# EAGLE design h-bridge_0.8 (EAGLE 8.0.0)

## Sheet 1 of 2
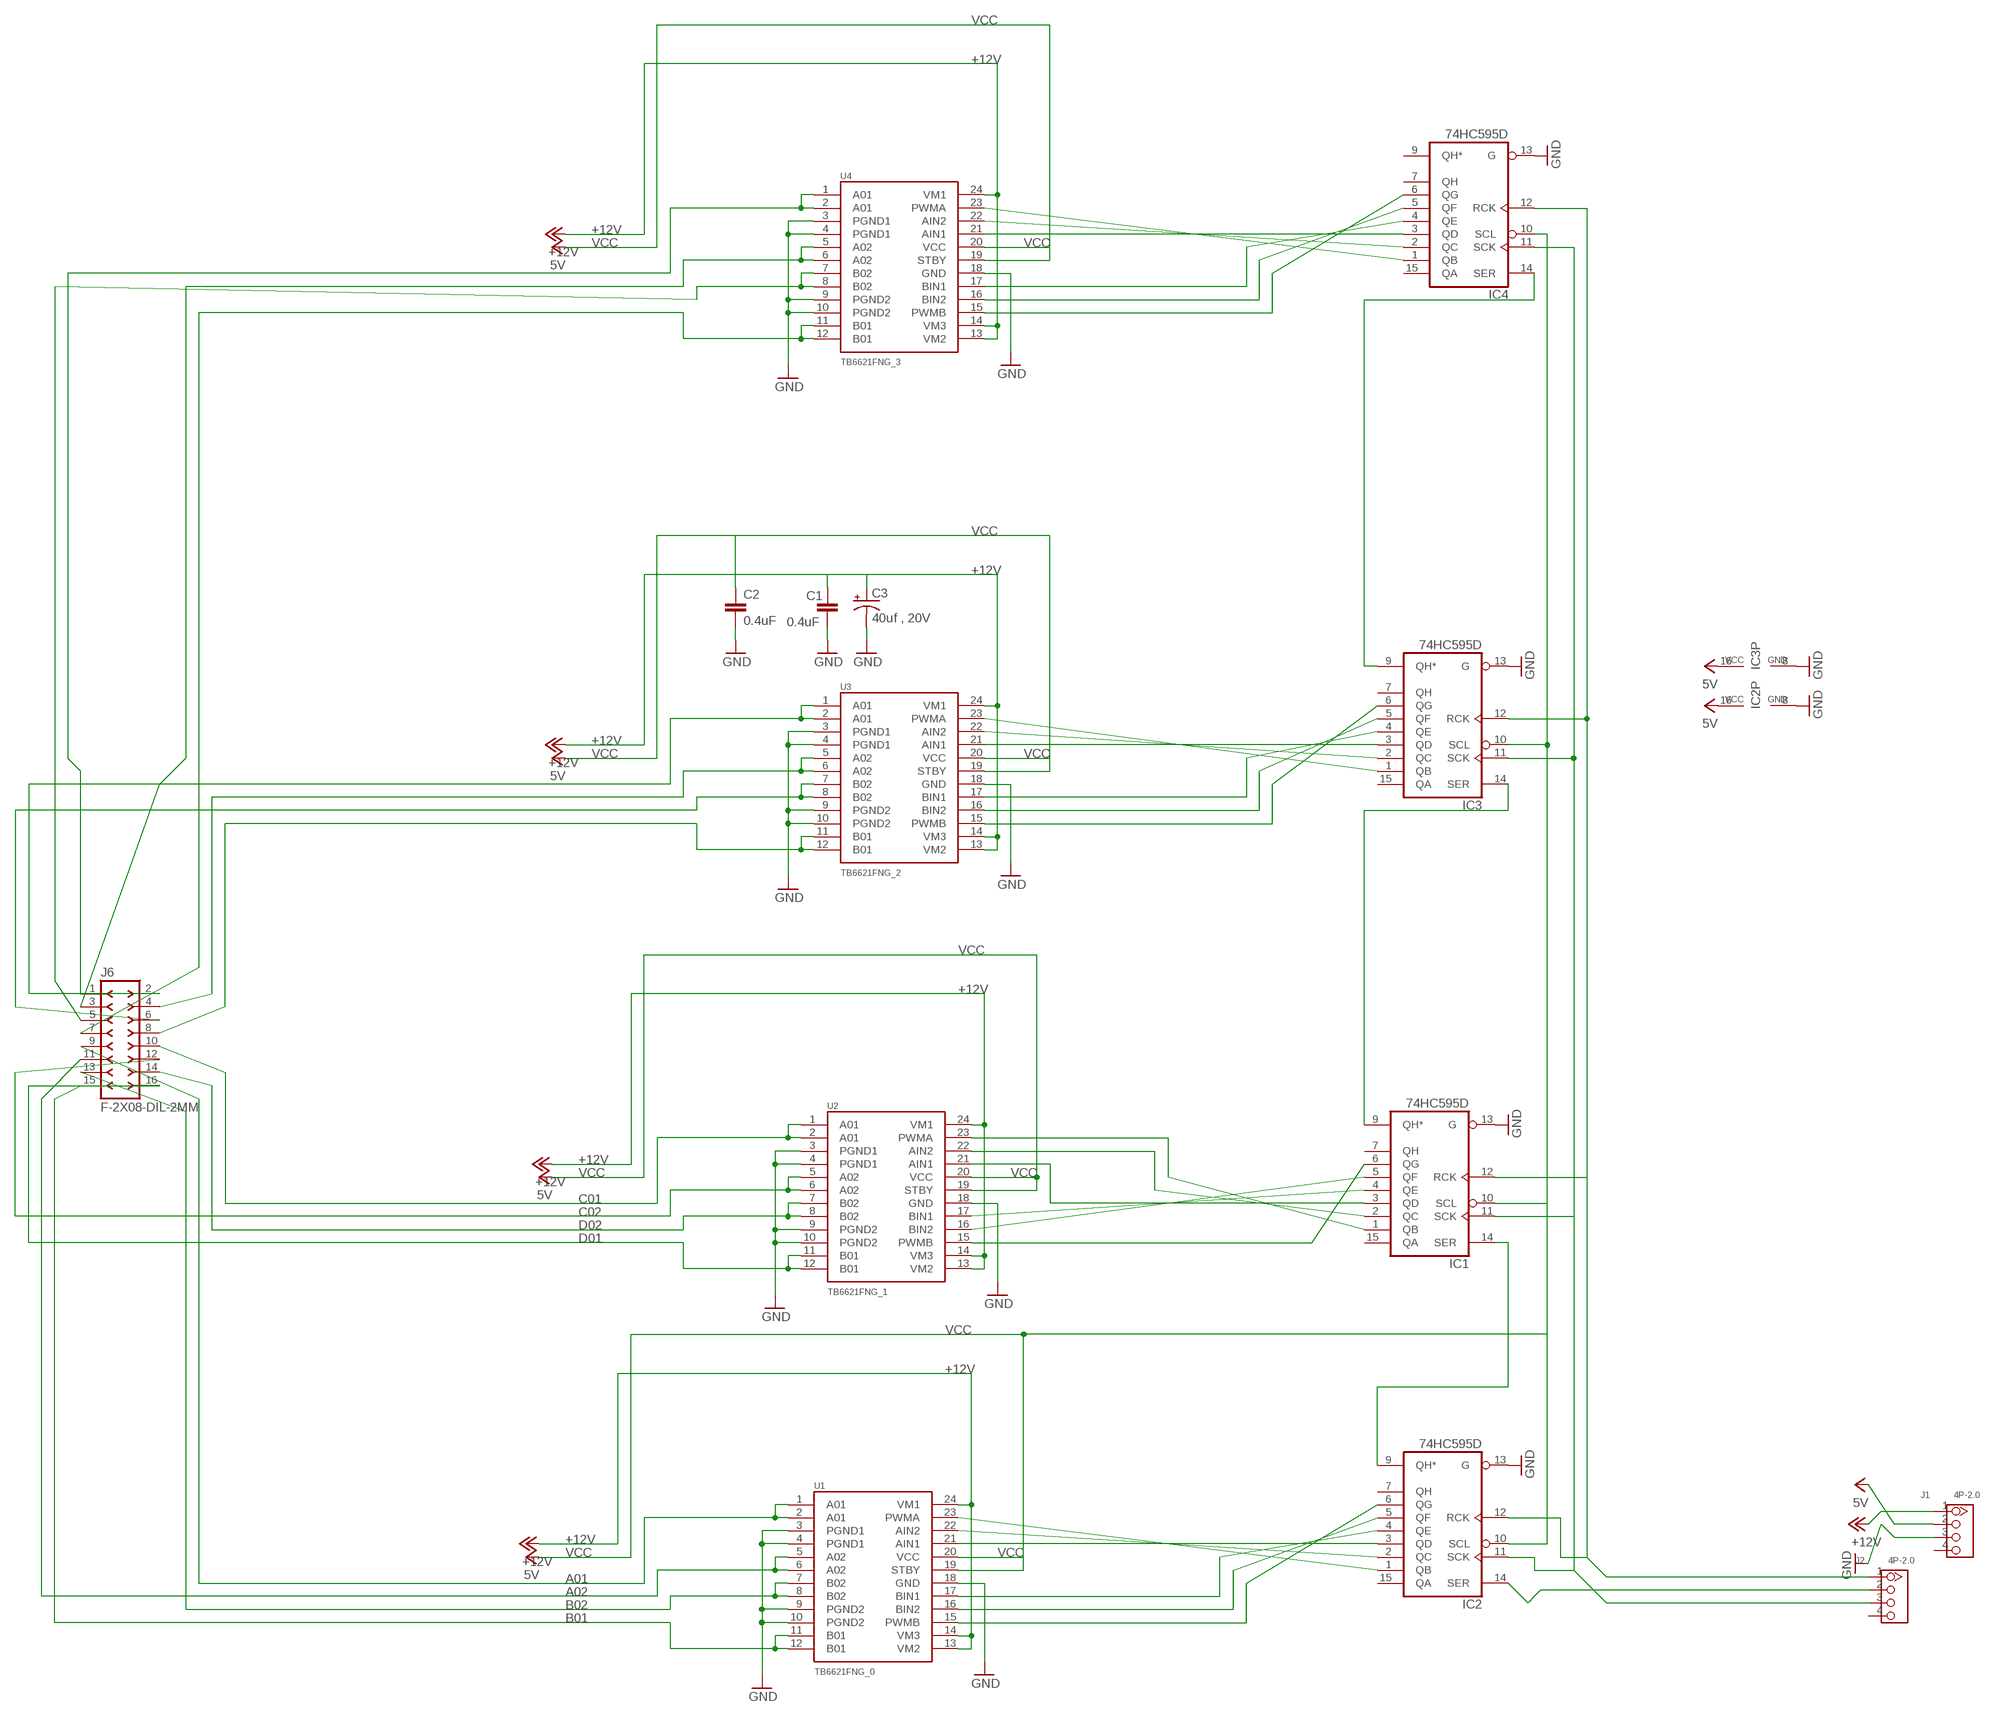
[diagram p0: schematic, sheet 1]

### Parts
C1  0.4uF  CAP0402-CAP  [0402-CAP]
C2  0.4uF  CAP0402-CAP  [0402-CAP]
C3  40uf , 20V  CAP_POL3528  [EIA3528]
IC1  74HC595D  [SO16]
IC2  74HC595D  [SO16]
IC3  74HC595D  [SO16]
IC4  74HC595D  [SO16]
J1  4P-2.0  GROVE-CONNECTOR-DIP(4P-2.0)  [HW4-2.0]
J2  4P-2.0  GROVE-CONNECTOR-DIP(4P-2.0)  [HW4-2.0]
J6  F-2X08-DIL-2MM  [DIL-2MM-2X08]
U1  TB6621FNG_0  TB6621FNG  [SSOP24]
U2  TB6621FNG_1  TB6621FNG  [SSOP24]
U3  TB6621FNG_2  TB6621FNG  [SSOP24]
U4  TB6621FNG_3  TB6621FNG  [SSOP24]

### Nets
+12V: C1.1 C3.A(+) J1.1 U1.13(VM2) U1.14(VM3) U1.24(VM1) U2.13(VM2) U2.14(VM3) U2.24(VM1) U3.13(VM2) U3.14(VM3) U3.24(VM1) U4.13(VM2) U4.14(VM3) U4.24(VM1)
A01: J6.9 U1.1(A01) U1.2(A01)
A02: J6.11 U1.5(A02) U1.6(A02)
B01: J6.15 U1.11(B01) U1.12(B01)
B02: J6.13 U1.7(B02) U1.8(B02)
C01: J6.10 U2.1(A01) U2.2(A01)
C02: J6.12 U2.5(A02) U2.6(A02)
D01: J6.16 U2.11(B01) U2.12(B01)
D02: J6.14 U2.7(B02) U2.8(B02)
E01: J6.2 U3.1(A01) U3.2(A01)
E01A: J6.1 U4.1(A01) U4.2(A01)
E02: J6.4 U3.5(A02) U3.6(A02)
E02A: J6.5 U4.7(B02) U4.8(B02)
F01: J6.8 U3.11(B01) U3.12(B01)
F01A: J6.7 U4.11(B01) U4.12(B01)
F02: J6.6 U3.7(B02) U3.8(B02)
F02A: J6.3 U4.5(A02) U4.6(A02)
GND: C1.2 C2.2 C3.C(-) IC1.13(G) IC2.8(GND) IC2.13(G) IC3.8(GND) IC3.13(G) IC4.13(G) J1.3 U1.3(PGND1) U1.4(PGND1) U1.9(PGND2) U1.10(PGND2) U1.18(GND) U2.3(PGND1) U2.4(PGND1) U2.9(PGND2) U2.10(PGND2) U2.18(GND) U3.3(PGND1) U3.4(PGND1) U3.9(PGND2) U3.10(PGND2) U3.18(GND) U4.3(PGND1) U4.4(PGND1) U4.9(PGND2) U4.10(PGND2) U4.18(GND)
N$1: IC2.5(QF) U1.16(BIN2)
N$2: IC3.5(QF) U3.16(BIN2)
N$3: IC2.2(QC) U1.22(AIN2)
N$4: IC3.4(QE) U3.17(BIN1)
N$5: IC2.6(QG) U1.15(PWMB)
N$6: IC2.1(QB) U1.23(PWMA)
N$8: IC2.14(SER) J2.2
N$10: IC1.14(SER) IC2.9(QH*)
N$11: IC2.4(QE) U1.17(BIN1)
N$12: IC1.6(QG) U2.15(PWMB)
N$13: IC2.3(QD) U1.21(AIN1)
N$14: IC1.5(QF) U2.16(BIN2)
N$15: IC1.4(QE) U2.17(BIN1)
N$16: IC1.3(QD) U2.21(AIN1)
N$17: IC1.2(QC) U2.22(AIN2)
N$18: IC1.9(QH*) IC3.14(SER)
N$19: IC1.1(QB) U2.23(PWMA)
N$20: IC3.3(QD) U3.21(AIN1)
N$21: IC3.6(QG) U3.15(PWMB)
N$22: IC3.2(QC) U3.22(AIN2)
N$24: IC3.1(QB) U3.23(PWMA)
N$25: IC1.11(SCK) IC2.11(SCK) IC3.11(SCK) IC4.11(SCK)
N$26: IC1.12(RCK) IC2.12(RCK) IC3.12(RCK) IC4.12(RCK) J2.1
N$27: IC4.6(QG) U4.15(PWMB)
N$28: IC3.9(QH*) IC4.14(SER)
N$29: IC4.5(QF) U4.16(BIN2)
N$30: IC4.4(QE) U4.17(BIN1)
N$31: IC4.3(QD) U4.21(AIN1)
N$33: IC4.2(QC) U4.22(AIN2)
N$34: IC4.1(QB) U4.23(PWMA)
VCC: C2.1 IC1.10(SCL) IC2.10(SCL) IC2.16(VCC) IC3.10(SCL) IC3.16(VCC) IC4.10(SCL) J1.2 U1.19(STBY) U1.20(VCC) U2.19(STBY) U2.20(VCC) U3.19(STBY) U3.20(VCC) U4.19(STBY) U4.20(VCC) ; supply symbol labelled 5V
Unconnected: IC1.7(QH) IC1.15(QA) IC2.7(QH) IC2.15(QA) IC3.7(QH) IC3.15(QA) IC4.7(QH) IC4.9(QH*) IC4.15(QA) J1.4 J2.3 J2.4

## Sheet 2 of 2

## Power pins joined to a net without a drawn wire
GND: IC1.8(GND) IC4.8(GND)
VCC: IC1.16(VCC) IC4.16(VCC)

## Library data of the parts
C1 C2 = SparkFun:CAP: Capacitor Standard 0603 ceramic capacitor, and 0.1" leaded capacitor.
C3 = SparkFun:CAP_POL: Capacitor Polarized These are standard SMD and PTH capacitors. Normally 10uF, 47uF, and 100uF in electrolytic and tantalum varieties. Always verify the external diameter of the through hole cap, it varies with capacity, voltage, and manufacturer. The EIA devices should be standard.
IC1-IC4 = 74xx-eu:74*595: 8-bit SHIFT REGISTER, output latch
J1 J2 = Seeed-OPL-Connector:GROVE-CONNECTOR-DIP(4P-2.0): 320110033
J6 = con-headers-jp:F-2X08-: FEMALE HEADER
U1-U4 = SparkFun:TB6621FNG: Toshiba 1A motor driver

## Board
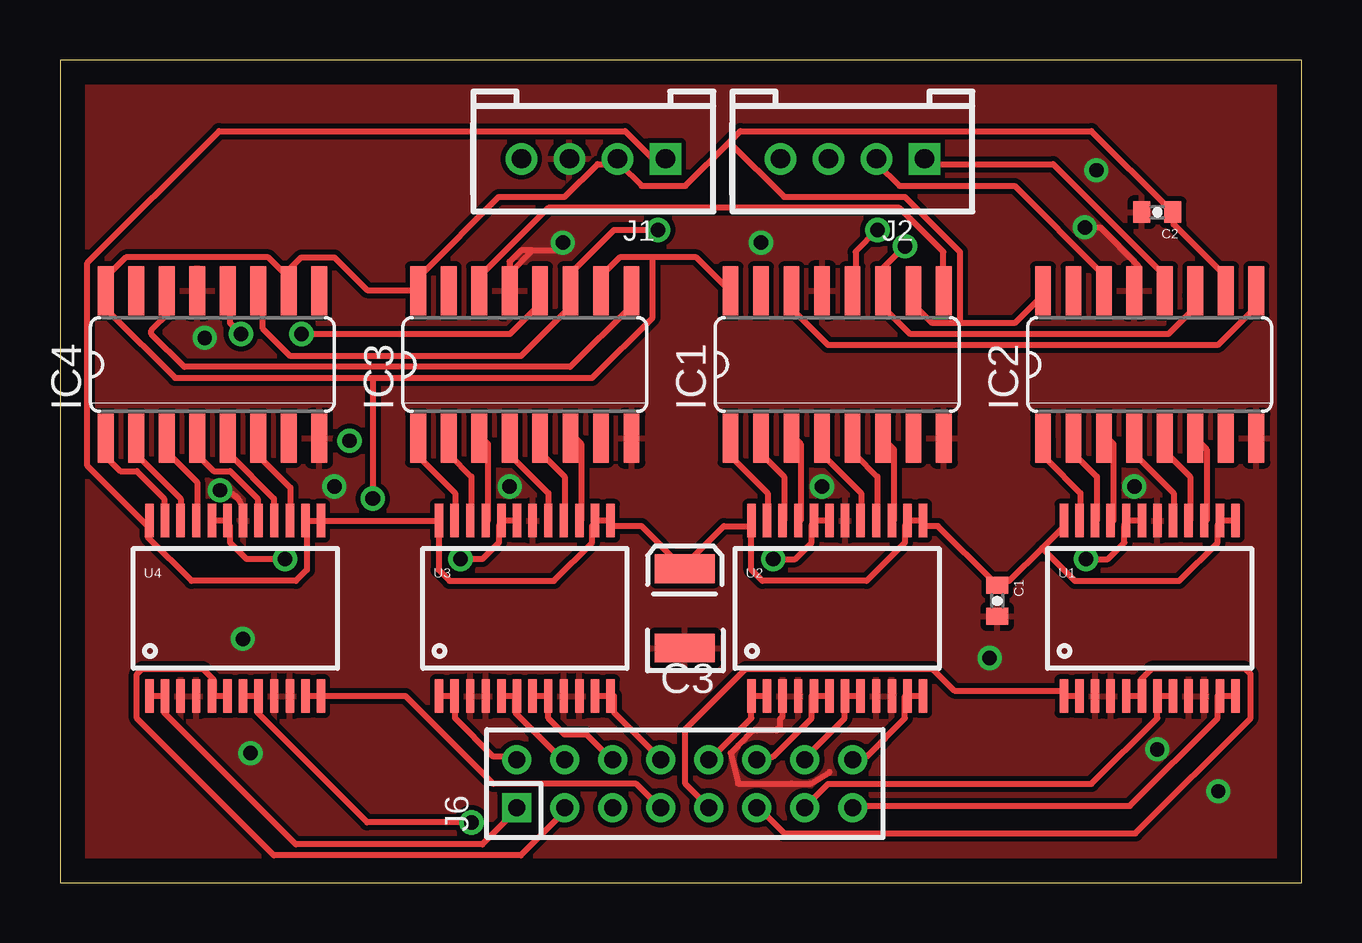
[diagram p1: board, top side]
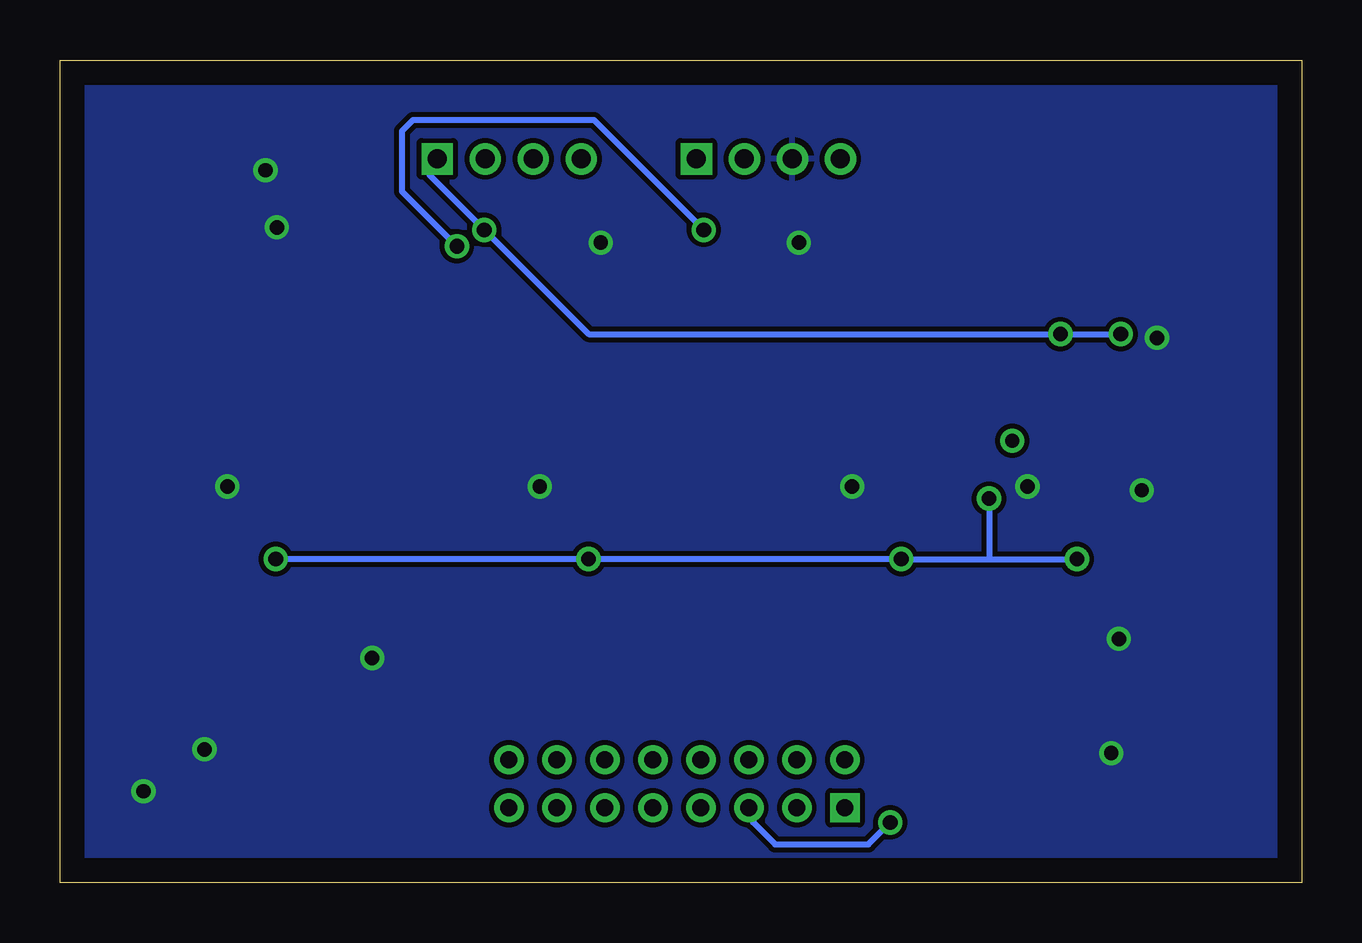
[diagram p2: board, bottom side, seen from below]

Size 51.74 x 34.28 mm. Coordinates in mm from the lower left corner, seen from the top.
Outline: 0,0 51.74,0 51.74,34.28 0,34.28 0,0
Copper layers (1*16): Top 0.035mm / dielectric 1.5mm / Bottom 0.035mm
Design rules "default": minimum track width 10mil, minimum drill 24mil, track to track 8mil, track to pad 8mil, pad to pad 8mil, via to via 8mil, smd to smd 8mil, copper to edge 40mil, drill to drill 8mil, minimum pad ring 10mil, minimum via ring 8mil, stop-mask expansion 4mil, vias tented up to drill 0mil, thermal gap 10mil

### Footprints (pad centres in the part's own frame; a part is rotated, then mirrored left to right if it is on the bottom)
0402-CAP = smd 0.7 x 0.9: 1 -0.65,0; 2 0.65,0
EIA3528 = smd 1.2 x 2.5: A 1.65,0; C -1.65,0
SO16 = smd 0.66 x 2.032: 1 -4.445,-3.073; 2 -3.175,-3.073; 3 -1.905,-3.073; 4 -0.635,-3.073; 5 0.635,-3.073; 6 1.905,-3.073; 7 3.175,-3.073; 8 4.445,-3.073; 9 4.445,3.073; 10 3.175,3.073; 11 1.905,3.073; 12 0.635,3.073; 13 -0.635,3.073; 14 -1.905,3.073; 15 -3.175,3.073; 16 -4.445,3.073
HW4-2.0 = drill 0.8 pad 1.27 square: 1 -3,0 | drill 0.8 pad 1.27: 2 -1,0; 3 1,0; 4 3,0
DIL-2MM-2X08 = drill 0.711 square: 1 -7,-1 | drill 0.711: 2 -7,1; 3 -5,-1; 4 -5,1; 5 -3,-1; 6 -3,1; 7 -1,-1; 8 -1,1; 9 1,-1; 10 1,1; 11 3,-1; 12 3,1; 13 5,-1; 14 5,1; 15 7,-1; 16 7,1
SSOP24 = smd 0.348 x 1.397: 1 -3.575,-3.656; 2 -2.925,-3.656; 3 -2.275,-3.656; 4 -1.625,-3.656; 5 -0.975,-3.656; 6 -0.325,-3.656; 7 0.325,-3.656; 8 0.975,-3.656; 9 1.625,-3.656; 10 2.275,-3.656; 11 2.925,-3.656; 12 3.575,-3.656; 13 3.575,3.656; 14 2.925,3.656; 15 2.275,3.656; 16 1.625,3.656; 17 0.975,3.656; 18 0.325,3.656; 19 -0.325,3.656; 20 -0.975,3.656; 21 -1.625,3.656; 22 -2.275,3.656; 23 -2.925,3.656; 24 -3.575,3.656

### Placement (x,y rotation side)
C1  39.05,11.75 270 top
C2  45.72,27.94 180 top
C3  26.04,11.43 90 top
IC1  32.38,21.59 0 top
IC2  45.4,21.59 0 top
IC3  19.37,21.59 0 top
IC4  6.35,21.59 0 top
J1  22.23,30.16 180 top
J2  33.02,30.16 180 top
J6  26.04,4.13 0 top
U1  45.4,11.43 0 top
U2  32.38,11.43 0 top
U3  19.37,11.43 0 top
U4  7.3,11.43 0 top

### Tracks (layer width: path | path; a pad name or v marks a point on that pad's centre or on a via)
+12V
  Top 0.254: 28.8,14.86 27.66,14.86 26.06,13.26 C3.A 25.83,13.26 24.23,14.86 23.09,14.86 U3.13 22.86,15.09 22.4,15.09 U3.14 22.17,14.86 22.17,14.17 20.57,12.57 16.23,12.57 15.77,13.03 15.77,14.86 U3.24 15.77,15.09 10.97,15.09 U4.13 10.74,15.09 10.29,15.09 U4.14 10.29,14.86 10.29,13.03 9.83,12.57 5.49,12.57 3.66,14.4 3.66,14.86 | U1.13 48.92,15.09 48.46,15.09 U1.14 48.23,14.86 48.23,14.17 46.63,12.57 42.29,12.57 40.92,13.95 | 40.92,13.95 41.83,14.86 U1.24 | 40.92,13.95 39.55,12.57 39.09,12.57 C1.1 38.86,12.57 36.58,14.86 36.12,14.86 U2.13 35.89,15.09 35.43,15.09 U2.14 35.2,14.86 35.2,14.17 33.6,12.57 29.26,12.57 28.8,13.03 28.8,14.86 | 28.8,14.86 U2.24 | 3.66,14.86 1.14,17.37 1.14,25.83 6.63,31.32 23.55,31.32 24.69,30.18 25.15,30.18 J1.1 | 3.66,14.86 U4.24
A01
  Top 0.254: U1.2 42.52,7.77 U1.1 41.83,8 37.26,8 36.35,8.91 28.57,8.91 26.06,6.4 26.06,4.12 26.98,3.2 J6.9
A02
  Top 0.254: U1.5 44.58,7.77 45.03,7.77 U1.6 45.03,8 45.03,8.46 45.49,8.91 49.38,8.91 49.61,8.69 49.61,6.86 44.81,2.06 30.18,2.06 29.26,2.97 J6.11
B01
  Top 0.254: U1.12 48.92,7.77 48.46,7.77 U1.11 48.23,7.77 48.23,6.86 44.58,3.2 33.15,3.2 J6.15
B02
  Top 0.254: U1.7 46.41,7.77 U1.8 | U1.7 45.72,6.86 42.98,4.12 32,4.12 31.09,3.2 J6.13 | U1.7
C01
  Top 0.254: U2.1 29.49,7.77 U2.2 | U2.1 28.8,6.86 27.2,5.26 J6.10 | U2.1
C02
  Top 0.254: U2.6 32,7.77 31.55,7.77 U2.5 31.32,7.77 31.32,6.86 29.72,5.26 29.26,5.26 J6.12
D01
  Top 0.254: U2.12 35.89,7.77 35.43,7.77 U2.11 35.2,7.77 35.2,6.86 33.6,5.26 33.15,5.26 J6.16
D02
  Top 0.254: 32.69,7.77 33.38,7.77 U2.8 | 32.69,7.77 32.69,6.86 31.09,5.26 J6.14 | 32.69,7.77 U2.7
E01
  Top 0.254: 16.46,7.77 15.77,7.77 U3.1 | 16.46,7.77 16.46,6.86 18.06,5.26 18.97,5.26 J6.2 | 16.46,7.77 U3.2
E01A
  Top 0.254: 4.34,7.77 3.89,7.77 U4.1 | 4.34,7.77 4.34,7.09 9.83,1.6 17.6,1.6 18.97,2.97 J6.1 | 4.34,7.77 U4.2
E02
  Top 0.254: 18.97,7.77 18.52,7.77 U3.5 | 18.97,7.77 18.97,7.09 21.03,5.03 J6.4 | 18.97,7.77 U3.6
E02A  (via drill 0.61)
  Top 0.254: 8.23,7.77 7.77,7.77 U4.7 | 8.23,7.77 8.23,7.09 12.8,2.52 v17.14,2.52 | 8.23,7.77 U4.8
  Bottom 0.254: v17.14,2.52 18.06,1.6 21.95,1.6 22.86,2.52 22.86,2.97 J6.5
F01
  Top 0.254: U3.11 22.4,7.77 22.86,7.77 U3.12 23.09,7.77 23.09,7.09 24.92,5.26 J6.8
F01A
  Top 0.254: U4.11 10.29,7.77 10.74,7.77 U4.12 10.97,7.77 14.4,7.77 18.06,4.12 24,4.12 24.92,3.2 J6.7
F02
  Top 0.254: U3.8 19.66,7.77 U3.7 | U3.8 20.34,6.86 21.03,6.17 21.95,6.17 22.86,5.26 J6.6 | U3.8
F02A
  Top 0.254: U4.6 6.86,7.77 6.4,7.77 U4.5 6.4,8 6.4,8.46 5.94,8.91 3.43,8.91 3.2,8.69 3.2,6.86 8.91,1.14 19.2,1.14 21.03,2.97 J6.3
GND  (via drill 0.6)
  Top 0.254: v6.67,16.35 arc-90 7.63,15.39 U4.18 | 19.68,26.35 19.21,26.35 18.73,25.88 IC3.13 18.73,25.4 19.68,26.35 | 19.68,26.35 20.64,26.35 v20.95,26.67 | v42.7,27.3 43.34,27.3 44.93,25.72 44.93,24.82 IC2.13 | U2.3 30.11,6.93 30,6.83 30,6.51 29.84,6.35 29.05,6.35 28.89,6.35 28.26,5.71 27.94,5.4 28.26,4.13 30.48,4.13 31.27,4.13 32.07,4.6
  other vias: 7.62,10.16 7.94,5.4 11.43,16.51 6.03,22.7 18.73,16.51 29.21,26.67 31.75,16.51 44.77,16.51 38.73,9.37 43.18,29.69 45.72,5.56 48.26,3.81
  pour Top: -1.27,35.56 53.34,35.56 53.34,-1.27 -1.27,-1.27
  pour Bottom: 0,34.29 52.07,34.29 52.07,0 0,0
  pour Top: 7.62,15.88 7.62,15.56 7.3,15.88 6.03,15.88 6.03,16.83 6.99,16.83 6.99,16.51
  pour Top: 6.35,22.86 6.03,23.18 4.6,23.18 4.45,23.02 4.45,22.86 5.4,21.91 6.99,21.91 6.35,22.54
  pour Top: 19.05,25.4 19.53,25.88 21.27,25.88 23.02,27.62 20.48,27.62 18.26,25.4
  pour Top: 44.45,25.4 44.13,25.88 43.5,25.88 40.16,29.21 40.16,29.53 41.12,29.53 45.09,25.56 45.09,25.4
N$1
  Top 0.254: U1.16 47.09,15.09 47.09,16.92 46.18,17.83 46.18,18.52 IC2.5
N$2
  Top 0.254: U3.16 21.03,15.09 21.03,16.92 20.12,17.83 20.12,18.52 IC3.5
N$3
  Top 0.254: U1.22 43.2,15.09 43.2,16.92 42.29,17.83 42.29,18.52 IC2.2
N$4
  Top 0.254: U3.17 20.34,16.23 18.75,17.83 18.75,18.52 IC3.4
N$5
  Top 0.254: U1.15 47.78,15.09 47.78,18.06 IC2.6
N$6
  Top 0.254: U1.23 42.52,15.09 42.52,16.23 41.15,17.6 41.15,18.52 IC2.1
N$7  (via drill 0.6)
  other vias: 12.06,18.41
N$8
  Top 0.254: IC2.14 43.43,24.69 43.43,25.38 39.78,29.03 34.98,29.03 34.06,29.95 J2.2
N$9
  pour Bottom: 7.62,15.24 7.3,15.88 6.03,15.88 6.03,16.19 6.03,16.83 6.99,16.83 7.94,15.88 7.94,15.24
N$10
  Top 0.254: IC1.14 30.63,24.46 30.63,23.77 32,22.4 48.23,22.4 49.84,24 49.84,24.46 IC2.9
N$11
  Top 0.254: U1.17 46.41,15.09 46.41,16.23 44.81,17.83 44.81,18.52 IC2.4
N$12
  Top 0.254: IC1.6 34.75,18.06 34.75,15.09 U2.15
N$13
  Top 0.254: U1.21 43.89,15.09 43.89,18.29 43.66,18.52 IC2.3
N$14
  Top 0.254: U2.16 34.06,15.09 34.06,16.92 33.15,17.83 33.15,18.52 IC1.5
N$15
  Top 0.254: U2.17 33.38,15.09 33.38,16.23 31.77,17.83 31.77,18.52 IC1.4
N$16
  Top 0.254: U2.21 30.86,15.09 30.86,18.29 30.63,18.52 IC1.3
N$17
  Top 0.254: U2.22 30.18,15.09 30.18,16.92 29.26,17.83 29.26,18.52 IC1.2
N$18
  Top 0.254: IC3.14 17.6,24.69 17.6,25.38 20.34,28.12 34.98,28.12 36.8,26.29 36.8,24.69 IC1.9
N$19
  Top 0.254: U2.23 29.49,15.09 29.49,16.23 28.12,17.6 28.12,18.52 IC1.1
N$20
  Top 0.254: U3.21 17.83,15.09 17.83,18.29 17.6,18.52 IC3.3
N$21
  Top 0.254: U3.15 21.72,15.09 21.72,18.29 21.49,18.52 IC3.6
N$22
  Top 0.254: U3.22 17.14,15.09 17.14,16.92 16.23,17.83 16.23,18.52 IC3.2
N$24
  Top 0.254: U3.23 16.46,15.09 16.46,16.23 15.09,17.6 15.09,18.52 IC3.1
N$25  (via drill 0.61)
  Top 0.254: IC2.11 47.09,24.46 47.09,23.77 46.18,22.86 35.43,22.86 34.29,24 IC1.11 34.29,25.6 v35.2,26.52 | IC4.11 8.46,24.46 8.46,23.09 9.6,21.95 19.2,21.95 21.26,24 21.26,24.46 IC3.11 21.49,24.69 21.49,25.6 23.09,27.2 v24.92,27.2
  Bottom 0.254: v35.2,26.52 37.49,28.8 37.49,31.32 37.03,31.77 29.49,31.77 v24.92,27.2
N$26  (via drill 0.61)
  Top 0.254: v7.54,22.86 7.09,23.32 7.09,24.46 IC4.12 | v10.06,22.86 18.75,22.86 19.89,24 19.89,24.46 IC3.12 | v34.06,27.2 33.15,26.29 33.15,24.69 IC1.12 | IC2.12 45.95,24.69 45.95,25.38 41.38,29.95 36.12,29.95 J2.1
  Bottom 0.254: v7.54,22.86 v10.06,22.86 29.72,22.86 v34.06,27.2 36.35,29.49 36.35,29.72 36.12,29.95 J2.1
N$27
  Top 0.254: U4.15 9.6,15.09 9.6,16.46 8.46,17.6 8.46,18.52 IC4.6
N$28
  Top 0.254: IC4.14 4.57,24.46 4.57,23.77 3.81,23.01 3.81,22.86 5.18,21.49 21.26,21.49 23.77,24 23.77,24.46 IC3.9
N$29
  Top 0.254: U4.16 8.91,15.09 8.91,16 7.09,17.83 7.09,18.52 IC4.5
N$30
  Top 0.254: IC4.4 5.71,17.83 6.4,17.14 7.09,17.14 8.23,16 8.23,15.09 U4.17
N$31
  Top 0.254: U4.21 5.71,15.09 5.71,16.69 4.57,17.83 4.57,18.52 IC4.3
N$33
  Top 0.254: U4.22 5.03,16 3.2,17.83 3.2,18.52 IC4.2
N$34
  Top 0.254: U4.23 4.34,15.09 4.34,16 3.2,17.14 2.52,17.14 2.06,17.6 2.06,18.52 IC4.1
VCC  (via drill 0.61)
  Top 0.254: U1.19 45.03,15.09 44.58,15.09 U1.20 44.35,14.86 44.35,14.17 43.66,13.49 v42.75,13.49 | U2.19 32,15.09 31.55,15.09 U2.20 31.32,14.86 31.32,14.17 30.63,13.49 v29.72,13.49 | U4.20 6.4,15.09 6.86,15.09 U4.19 7.09,14.86 7.09,14.17 7.77,13.49 v9.37,13.49 | U3.19 18.97,15.09 18.52,15.09 U3.20 18.29,14.86 18.29,14.17 17.6,13.49 v16.69,13.49 | 37.49,23.32 39.78,23.32 40.92,24.46 IC2.16 | 37.49,23.32 36.35,23.32 35.66,24 35.66,24.46 IC1.10 | 24.69,26.06 26.52,26.06 27.89,24.69 IC1.16 | 24.69,26.06 23.32,26.06 22.63,25.38 22.63,24.69 IC3.10 | IC2.10 48.46,24.69 48.46,25.38 46.41,27.43 46.41,27.89 C2.1 46.18,28.12 42.98,31.32 28.35,31.32 27.89,30.86 | 9.37,25.38 8.69,26.06 2.74,26.06 2.06,25.38 2.06,24.69 IC4.16 2.06,24.46 2.06,23.77 4.8,21.03 13.03,21.03 | 9.37,25.38 9.37,24.69 IC4.10 9.37,25.38 | 9.37,25.38 10.06,26.06 11.43,26.06 12.8,24.69 14.86,24.69 IC3.16 15.09,24.69 15.09,25.38 18.29,28.57 21.03,28.57 22.4,29.95 23.09,29.95 J1.2 23.32,29.95 24.23,29.03 26.06,29.03 27.89,30.86 | 24.69,26.06 24.69,23.55 22.17,21.03 13.03,21.03 | 37.49,23.32 37.49,26.29 35.2,28.57 30.18,28.57 27.89,30.86 | 13.03,21.03 v13.03,16
  Bottom 0.254: 13.03,13.49 v16.69,13.49 v29.72,13.49 v42.75,13.49 | 13.03,13.49 v9.37,13.49 | v13.03,16 13.03,13.49